# Altium schematic sheet Esquematico.SchDoc
size A4; SheetNumber: 1; SheetTotal: 4
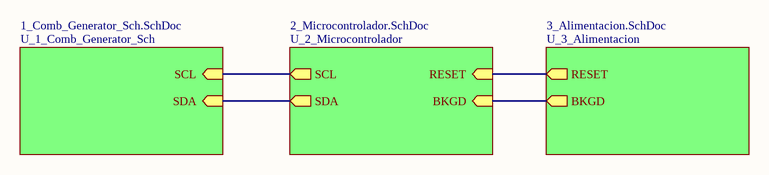
[diagram p0: Esquematico.SchDoc]

## Sub-sheets
U_1_Comb_Generator_Sch = 1_Comb_Generator_Sch.SchDoc: SCL (in), SDA (in)
U_2_Microcontrolador = 2_Microcontrolador.SchDoc: RESET (in), BKGD (in), SCL (out), SDA (out)
U_3_Alimentacion = 3_Alimentacion.SchDoc: RESET (out), BKGD (out)

## Nets
(unnamed): sheet U_1_Comb_Generator_Sch/SCL, sheet U_2_Microcontrolador/SCL
(unnamed): sheet U_1_Comb_Generator_Sch/SDA, sheet U_2_Microcontrolador/SDA
(unnamed): sheet U_2_Microcontrolador/RESET, sheet U_3_Alimentacion/RESET
(unnamed): sheet U_2_Microcontrolador/BKGD, sheet U_3_Alimentacion/BKGD